# EAGLE design digital (EAGLE 6.5.0)
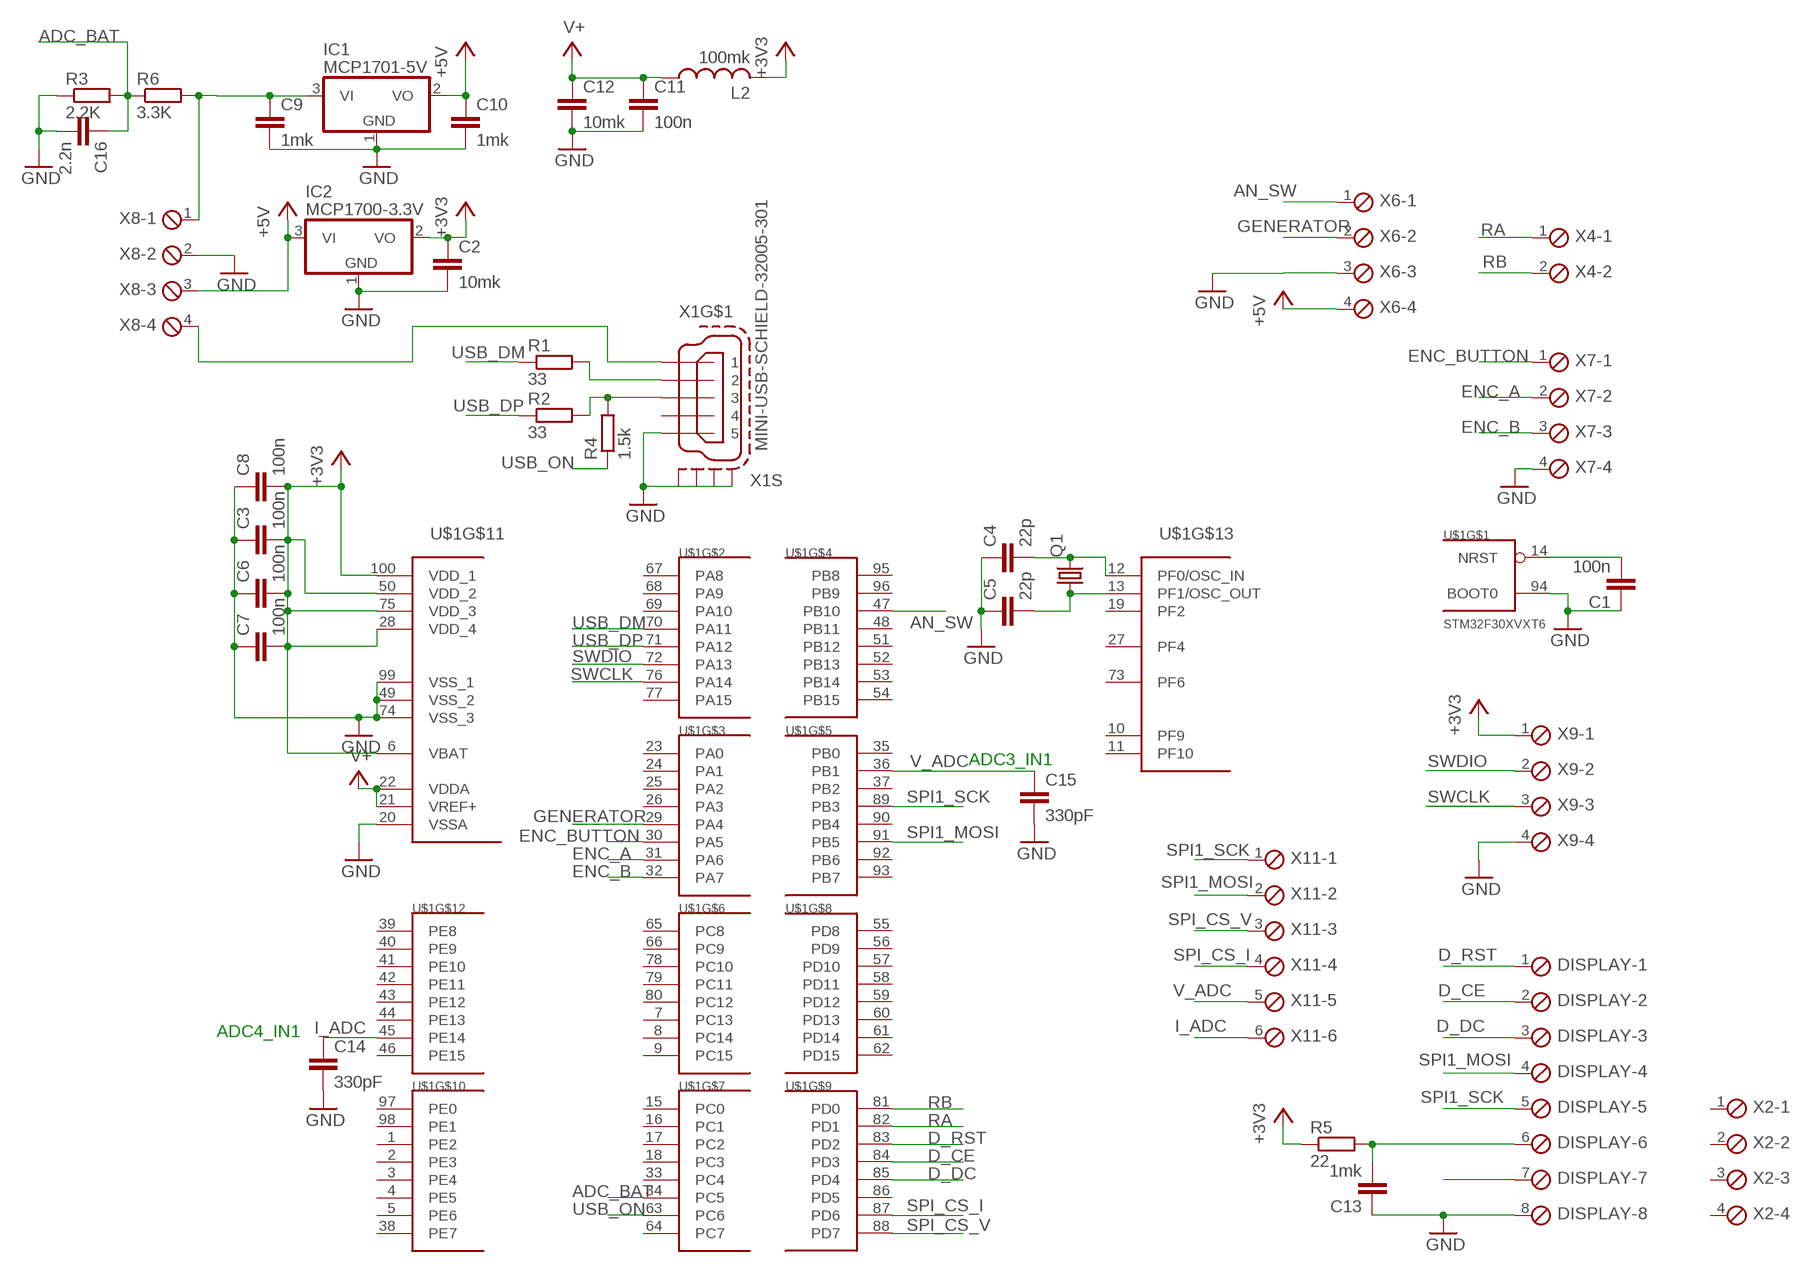
[diagram p0: schematic, sheet 1]

## Parts
C1  100n  C-EUC0603  [C0603]
C2  10mk  C-EUC0805  [C0805]
C3  100n  C-EUC0603  [C0603]
C4  22p  C-EUC0805  [C0805]
C5  22p  C-EUC0805  [C0805]
C6  100n  C-EUC0603  [C0603]
C7  100n  C-EUC0603  [C0603]
C8  100n  C-EUC0603  [C0603]
C9  1mk  C-EUC0603  [C0603]
C10  1mk  C-EUC0603  [C0603]
C11  100n  C-EUC0603  [C0603]
C12  10mk  C-EUC0805  [C0805]
C13  1mk  C-EUC0603  [C0603]
C14  330pF  C-EUC0805  [C0805]
C15  330pF  C-EUC0805  [C0805]
C16  2.2n  C-EUC0805  [C0805]
DISPLAY  MPT8  [8POL254]
IC1  MCP1701-5V  MCP1703CB  [SOT23]
IC2  MCP1700-3.3V  MCP1703CB  [SOT23]
L2  100mk  L-US0204/7  [0204/7]
Q1  CRYSTALHC49UP  [HC49UP]
R1  33  R-EU_R0603  [R0603]
R2  33  R-EU_R0603  [R0603]
R3  2.2K  R-EU_R0603  [R0603]
R4  1.5k  R-EU_R0603  [R0603]
R5  22  R-EU_R0603  [R0603]
R6  3.3K  R-EU_R0603  [R0603]
U$1  STM32F30XVXT6  [TQFP100]
X1  MINI-USB-SCHIELD-32005-301  [32005-301]
X2  MPT4  [4POL254]
X4  MPT2  [2POL254]
X6  MPT4  [4POL254]
X7  MPT4  [4POL254]
X8  MPT4  [4POL254]
X9  MPT4  [4POL254]
X11  MPT6  [6POL254]

## Nets
+3V3: C2.1 C3.2 C6.2 C7.2 C8.2 IC2.2(VO) L2.2 R5.1 U$1.6(VBAT) U$1.28(VDD_4) U$1.50(VDD_2) U$1.75(VDD_3) U$1.100(VDD_1) X9.1
+5V: C10.1 IC1.2(VO) IC2.3(VI) X6.4 X8.3
ADC_BAT: C16.1 R3.2 R6.1 U$1.34(PC5)
AN_SW: U$1.47(PB10) X6.1
D_CE: DISPLAY.2 U$1.84(PD3)
D_DC: DISPLAY.3 U$1.85(PD4)
D_RST: DISPLAY.1 U$1.83(PD2)
ENC_A: U$1.31(PA6) X7.2
ENC_B: U$1.32(PA7) X7.3
ENC_BUTTON: U$1.30(PA5) X7.1
GENERATOR: U$1.29(PA4) X6.2
GND: C1.1 C2.2 C3.1 C4.1 C5.1 C6.1 C7.1 C8.1 C9.2 C10.2 C11.2 C12.2 C13.1 C14.2 C15.2 C16.2 DISPLAY.8 IC1.1(GND) IC2.1(GND) R3.1 U$1.20(VSSA) U$1.49(VSS_2) U$1.74(VSS_3) U$1.94(BOOT0) U$1.99(VSS_1) X1.5 X1.M1(S:S1) X1.M2(S:S2) X1.M3(S:S3) X1.M4(S:S4) X6.3 X7.4 X8.2 X9.4
I_ADC: C14.1 U$1.45(PE14) X11.6
N$1: R1.2 X1.2
N$2: R2.2 R4.2 X1.3
N$3: C1.2 U$1.14(NRST)
N$4: C4.2 Q1.2 U$1.12(PF0/OSC_IN)
N$5: C5.2 Q1.1 U$1.13(PF1/OSC_OUT)
N$6: C13.2 DISPLAY.6 R5.2
N$7: C9.1 IC1.3(VI) R6.2 X8.1
N$8: X1.1 X8.4
N$13: DISPLAY.7
RA: U$1.82(PD1) X4.1
RB: U$1.81(PD0) X4.2
SPI1_MOSI: DISPLAY.4 U$1.91(PB5) X11.2
SPI1_SCK: DISPLAY.5 U$1.89(PB3) X11.1
SPI_CS_I: U$1.87(PD6) X11.4
SPI_CS_V: U$1.88(PD7) X11.3
SWCLK: U$1.76(PA14) X9.3
SWDIO: U$1.72(PA13) X9.2
USB_DM: R1.1 U$1.70(PA11)
USB_DP: R2.1 U$1.71(PA12)
USB_ON: R4.1 U$1.63(PC6)
V+: C11.1 C12.1 L2.1 U$1.21(VREF+) U$1.22(VDDA)
V_ADC: C15.1 U$1.36(PB1) X11.5
Unconnected: U$1.1(PE2) U$1.2(PE3) U$1.3(PE4) U$1.4(PE5) U$1.5(PE6) U$1.7(PC13) U$1.8(PC14) U$1.9(PC15) U$1.10(PF9) U$1.11(PF10) U$1.15(PC0) U$1.16(PC1) U$1.17(PC2) U$1.18(PC3) U$1.19(PF2) U$1.23(PA0) U$1.24(PA1) U$1.25(PA2) U$1.26(PA3) U$1.27(PF4) U$1.33(PC4) U$1.35(PB0) U$1.37(PB2) U$1.38(PE7) U$1.39(PE8) U$1.40(PE9) U$1.41(PE10) U$1.42(PE11) U$1.43(PE12) U$1.44(PE13) U$1.46(PE15) U$1.48(PB11) U$1.51(PB12) U$1.52(PB13) U$1.53(PB14) U$1.54(PB15) U$1.55(PD8) U$1.56(PD9) U$1.57(PD10) U$1.58(PD11) U$1.59(PD12) U$1.60(PD13) U$1.61(PD14) U$1.62(PD15) U$1.64(PC7) U$1.65(PC8) U$1.66(PC9) U$1.67(PA8) U$1.68(PA9) U$1.69(PA10) U$1.73(PF6) U$1.77(PA15) U$1.78(PC10) U$1.79(PC11) U$1.80(PC12) U$1.86(PD5) U$1.90(PB4) U$1.92(PB6) U$1.93(PB7) U$1.95(PB8) U$1.96(PB9) U$1.97(PE0) U$1.98(PE1) X1.4 X2.1 X2.2 X2.3 X2.4

## Notes on the sheet
- ADC3_IN1
- ADC4_IN1

## Library data of the parts
C1-C16 = rcl:C-EU: CAPACITOR, European symbol
DISPLAY = con-phoenix-254:MPT8: PHOENIX CONNECTOR; OC_FARNELL: unknown; OC_NEWARK: unknown
IC1 IC2 = linear:MCP1703: 250 mA, 16V, Low Quiescent Current LDO Regulator Source: http://ww1.microchip.com/downloads/en/DeviceDoc/22049b.pdf
L2 = rcl:L-US: INDUCTOR, American symbol
Q1 = crystal:CRYSTAL: CRYSTAL; OC_FARNELL: unknown; OC_NEWARK: unknown
R1-R6 = rcl:R-EU_: RESISTOR, European symbol
U$1 = stm32:STM32F30XVXT6
X1 = con-cypressindustries:MINI-USB-SCHIELD-: MINI USB-B Conector Source: www.cypressindustries.com; OC_FARNELL: unknown; OC_NEWARK: unknown
X2 X6-X9 = con-phoenix-254:MPT4: PHOENIX CONNECTOR; OC_FARNELL: unknown; OC_NEWARK: unknown
X4 = con-phoenix-254:MPT2: PHOENIX CONNECTOR; OC_FARNELL: unknown; OC_NEWARK: unknown
X11 = con-phoenix-254:MPT6: PHOENIX CONNECTOR; OC_FARNELL: unknown; OC_NEWARK: unknown

## Board
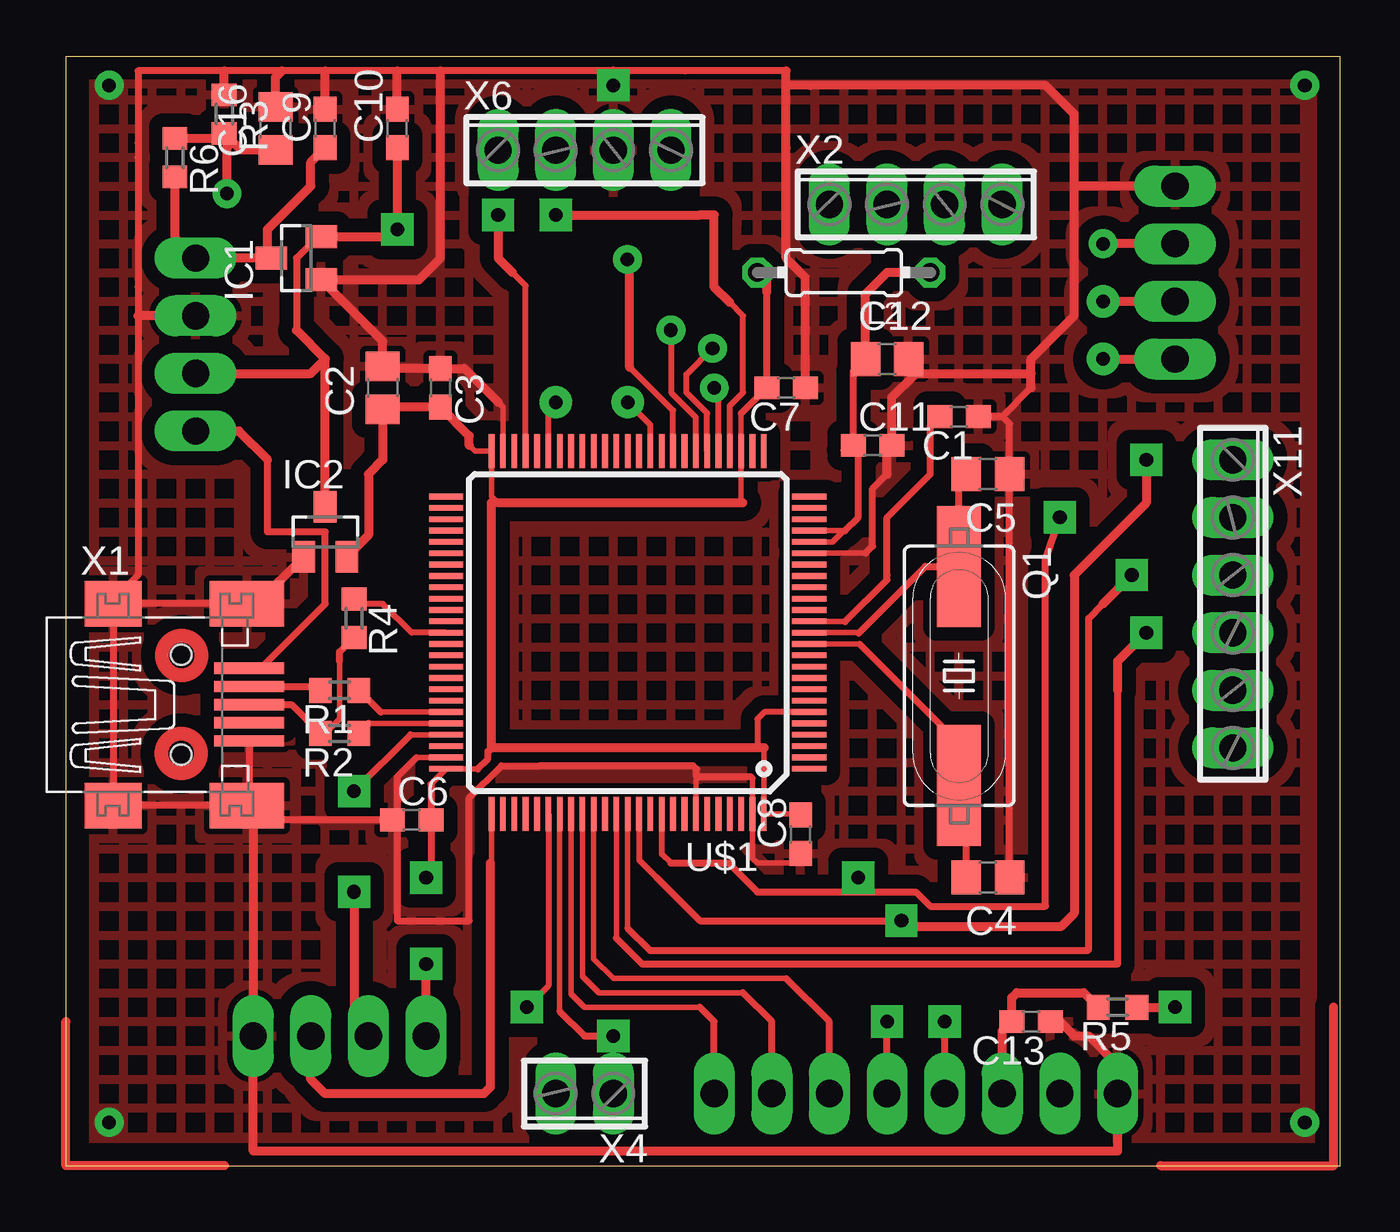
[diagram p1: board, top side]
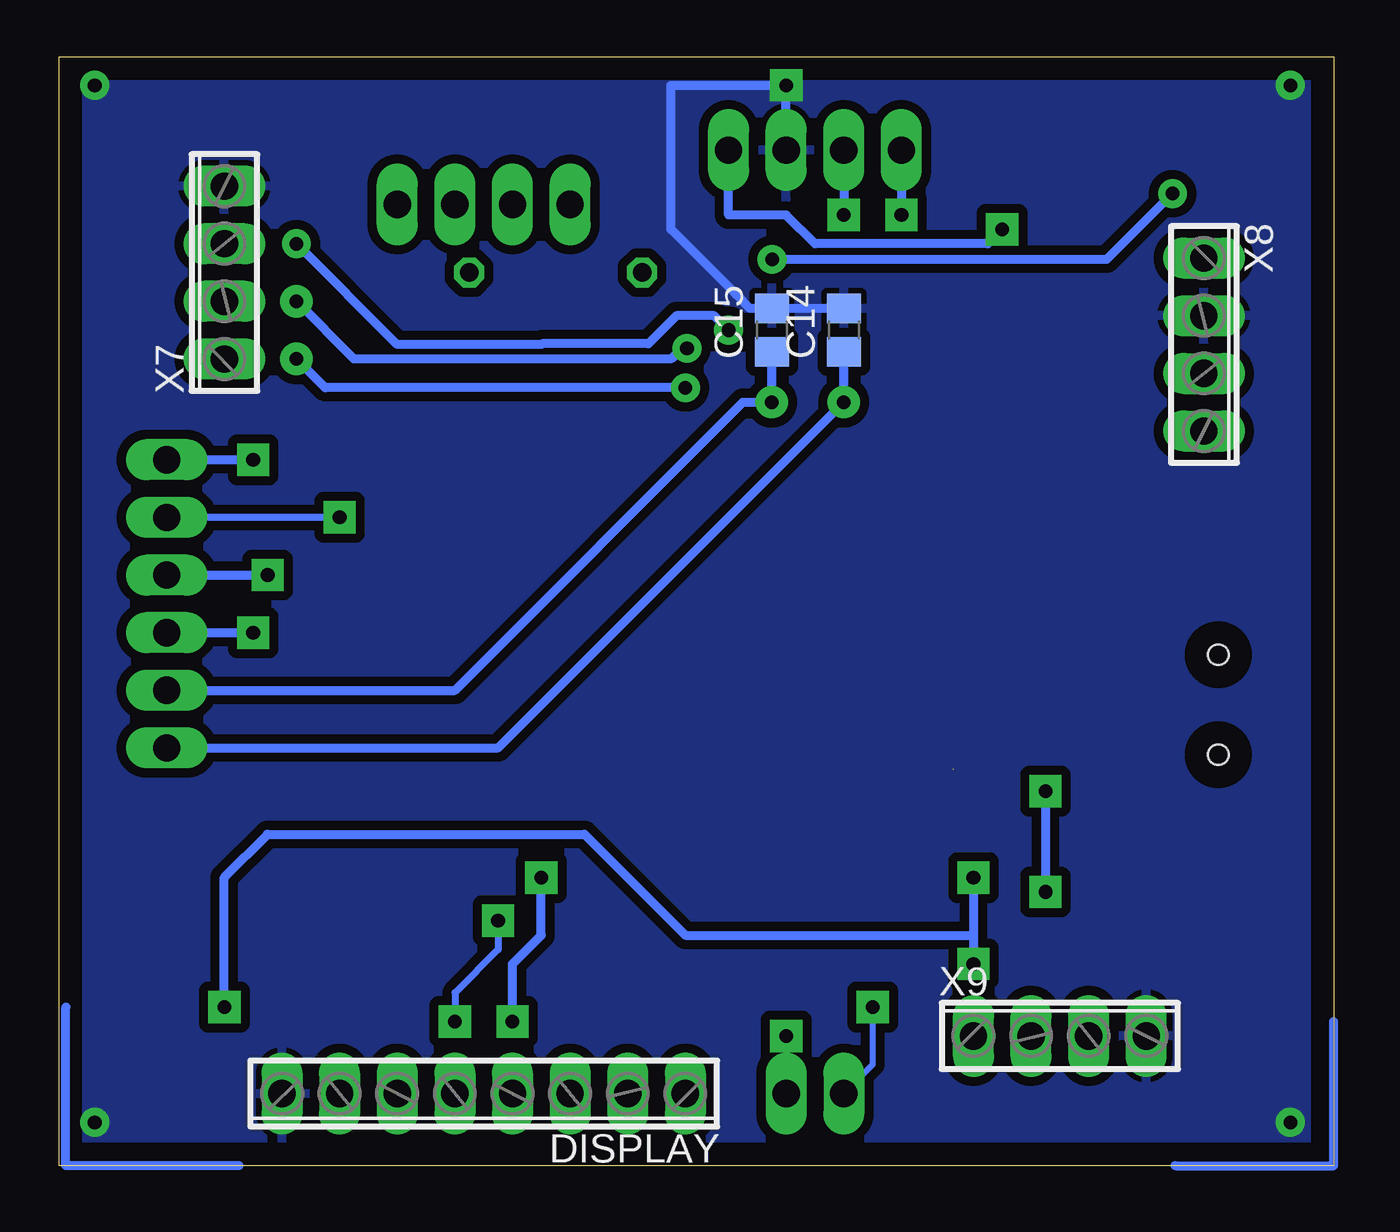
[diagram p2: board, bottom side, seen from below]

Size 56.19 x 48.88 mm. Coordinates in mm from the lower left corner, seen from the top.
Outline: 0,0 56.19,0 56.19,48.88 0,48.88 0,0
Copper layers (1*16): Top 0.035mm / dielectric 1.5mm / Bottom 0.035mm
Design rules "default": minimum track width 10mil, minimum drill 24mil, track to track 8mil, track to pad 8mil, pad to pad 8mil, via to via 8mil, smd to smd 8mil, copper to edge 40mil, drill to drill 8mil, minimum pad ring 10mil, minimum via ring 8mil, stop-mask expansion 4mil, vias tented up to drill 0mil, thermal gap 10mil

### Footprints (pad centres in the part's own frame; a part is rotated, then mirrored left to right if it is on the bottom)
C0603 = smd 1.1 x 1: 1 -0.85,0; 2 0.85,0
C0805 = smd 1.3 x 1.5: 1 -0.95,0; 2 0.95,0
8POL254 = drill 1.2 long: 1 -8.89,0; 2 -6.35,0; 3 -3.81,0; 4 -1.27,0; 5 1.27,0; 6 3.81,0; 7 6.35,0; 8 8.89,0
SOT23 = smd 1 x 1.4: 1 -0.95,-1.1; 2 0.95,-1.1; 3 0,1.1
0204/7 = drill 0.813 octagon: 1 -3.81,0; 2 3.81,0
HC49UP = smd 5.334 x 1.93: 1 -4.826,0; 2 4.826,0
R0603 = smd 1 x 1.1: 1 -0.85,0; 2 0.85,0
TQFP100 = smd 1.5 x 0.25: 1 -8,6; 2 -8,5.5; 3 -8,5; 4 -8,4.5; 5 -8,4; 6 -8,3.5; 7 -8,3; 8 -8,2.5; 9 -8,2; 10 -8,1.5; 11 -8,1; 12 -8,0.5; 13 -8,0; 14 -8,-0.5; 15 -8,-1; 16 -8,-1.5; 17 -8,-2; 18 -8,-2.5; 19 -8,-3; 20 -8,-3.5; 21 -8,-4; 22 -8,-4.5; 23 -8,-5; 24 -8,-5.5; 25 -8,-6; 51 8,-6; 52 8,-5.5; 53 8,-5; 54 8,-4.5; 55 8,-4; 56 8,-3.5; 57 8,-3; 58 8,-2.5; 59 8,-2; 60 8,-1.5; 61 8,-1; 62 8,-0.5; 63 8,0; 64 8,0.5; 65 8,1; 66 8,1.5; 67 8,2; 68 8,2.5; 69 8,3; 70 8,3.5; 71 8,4; 72 8,4.5; 73 8,5; 74 8,5.5; 75 8,6 | smd 0.25 x 1.5: 26 -6,-8; 27 -5.5,-8; 28 -5,-8; 29 -4.5,-8; 30 -4,-8; 31 -3.5,-8; 32 -3,-8; 33 -2.5,-8; 34 -2,-8; 35 -1.5,-8; 36 -1,-8; 37 -0.5,-8; 38 0,-8; 39 0.5,-8; 40 1,-8; 41 1.5,-8; 42 2,-8; 43 2.5,-8; 44 3,-8; 45 3.5,-8; 46 4,-8; 47 4.5,-8; 48 5,-8; 49 5.5,-8; 50 6,-8; 76 6,8; 77 5.5,8; 78 5,8; 79 4.5,8; 80 4,8; 81 3.5,8; 82 3,8; 83 2.5,8; 84 2,8; 85 1.5,8; 86 1,8; 87 0.5,8; 88 0,8; 89 -0.5,8; 90 -1,8; 91 -1.5,8; 92 -2,8; 93 -2.5,8; 94 -3,8; 95 -3.5,8; 96 -4,8; 97 -4.5,8; 98 -5,8; 99 -5.5,8; 100 -6,8
32005-301 = smd 3.1 x 0.5: 1 3,1.6; 2 3,0.8; 3 3,0; 4 3,-0.8; 5 3,-1.6 | smd 2.5 x 2: M1 -3,-4.45; M2 -3,4.45 | smd 3.3 x 2: M3 2.9,4.45; M4 2.9,-4.45 | hole 0.9: 0,2.2; 0,-2.2
4POL254 = drill 1.2 long: 1 -3.81,0; 2 -1.27,0; 3 1.27,0; 4 3.81,0
2POL254 = drill 1.2 long: 1 -1.27,0; 2 1.27,0
6POL254 = drill 1.2 pad 1.778 long: 1 -6.35,0; 2 -3.81,0; 3 -1.27,0; 4 1.27,0; 5 3.81,0; 6 6.35,0

### Placement (x,y rotation side)
C1  39.37,33.02 180 top
C2  13.97,34.29 90 top
C3  16.51,34.29 270 top
C4  40.64,12.7 180 top
C5  40.64,30.48 180 top
C6  15.24,15.24 0 top
C7  31.75,34.29 180 top
C8  32.38,14.61 90 top
C9  11.43,45.72 90 top
C10  14.61,45.72 90 top
C11  35.56,31.75 0 top
C12  36.2,35.56 0 top
C13  42.55,6.35 180 top
C14  21.59,36.83 90 bottom
C15  24.77,36.83 90 bottom
C16  9.24,45.72 90 top
DISPLAY  37.47,3.17 180 bottom
IC1  10.16,40.01 90 top
IC2  11.43,27.94 0 top
L2  34.29,39.37 180 top
Q1  39.37,21.59 270 top
R1  12.06,20.95 180 top
R2  12.06,19.05 180 top
R3  6.99,46.35 270 top
R4  12.7,24.13 270 top
R5  46.35,6.99 180 top
R6  4.8,44.44 270 top
U$1  24.77,23.5 180 top
X1  5.08,20.32 0 top
X2  37.47,42.38 0 top
X4  22.86,3.17 180 top
X6  22.86,44.77 0 top
X7  48.9,39.37 90 bottom
X8  5.71,36.2 270 bottom
X9  12.06,5.71 0 bottom
X11  51.44,24.77 270 top

### Tracks (layer width: path | path; a pad name or v marks a point on that pad's centre or on a via)
+3V3  (via drill 0.6 pad 1.42)  (1 unrouted)
  Top 0.25: 30.79,18.41 30.77,18.39 U$1.100 32.34,15.49 C8.2 | 18.15,17.48 16.78,17.48 16.75,17.48 16.09,16.82 | 19.05,29.21 18.77,29.5 U$1.50 18.04,31.5 17.78,31.75 | 29.84,29.21 29.77,29.29 U$1.28 29.77,33.16
  Top 0.254: U$1.6 30.79,20 30.48,19.68 30.48,18.41
  Top 0.305: 18.15,17.48 18.6,17.93 18.6,18.27 18.75,18.41 | 16.09,16.82 C6.2 16.09,12.91 v15.88,12.7 | 30.8,18.43 30.79,18.41 | 29.77,33.16 C7.2 30.9,38.52 | 19.05,29.21 18.75,29.21 | 12.7,26.52 IC2.2
  Top 0.406: 18.75,29.21 18.75,18.41 30.48,18.41 30.79,18.41 | 29.84,29.21 19.05,29.21 | IC2.2 13.34,27.8 13.34,30.48 13.97,31.11 C2.1 14.07,33.44 C3.2 17.78,32.17 17.78,31.75 | X9.1 v15.88,8.89 | 30.9,38.52 30.9,38.95 L2.2 | R5.1 v48.9,6.99
  Bottom 0.406: v15.88,12.7 15.88,10.16 | 15.88,10.16 v15.88,8.89 | v48.9,6.99 48.9,12.7 46.99,14.61 33.02,14.61 28.57,10.16 15.88,10.16
+5V  (via drill 0.6 pad 1.42)
  Top 0.305: 11.74,40.95 IC1.2 11.11,40.95 10.16,40.01 10.16,36.83
  Top 0.406: IC2.3 11.43,35.56 | 11.43,35.56 10.16,36.83 | X8.3 10.79,34.92 11.43,35.56 | 11.74,40.95 14.29,40.95 v14.61,41.27 C10.1
  Bottom 0.406: v14.61,41.27 15.24,40.64 22.86,40.64 24.13,41.91 26.67,41.91 X6.4
ADC_BAT  (via drill 0.6 pad 1.27)
  Top 0.254: U$1.34 26.77,33.28 24.85,35.2
  Top 0.406: C16.1 7.72,44.77 7.34,45.15 | 7.34,45.15 R3.2 6.76,45.28 R6.1 | 24.85,35.2 24.85,39.85 v24.75,39.95 | v7.1,42.85 7.1,44.9 7.34,45.15
  Bottom 0.406: v24.75,39.95 10,39.95 v7.1,42.85
AN_SW  (via drill 0.6 pad 1.42)
  Top 0.254: U$1.47 20.27,38.79 19.68,39.37
  Top 0.406: v19.05,41.91 19.05,40.01 19.68,39.37
  Bottom 0.406: X6.1 v19.05,41.91
D_CE
  Top 0.25: U$1.84 22.77,8.35 23.5,7.62 29.84,7.62
  Top 0.305: DISPLAY.2 31.11,6.35 29.84,7.62
D_DC
  Top 0.25: U$1.85 23.27,9.12 24.13,8.26 31.75,8.26
  Top 0.305: DISPLAY.3 33.66,6.35 31.75,8.26
D_RST
  Top 0.25: U$1.83 22.27,7.58 22.86,6.99 27.94,6.99
  Top 0.305: DISPLAY.1 28.57,6.35 27.94,6.99
ENC_A  (via drill 0.6 pad 1.27, 0.6 pad 1.42)
  Top 0.254: U$1.31 28.27,33.16 27.35,34.08 27.35,34.88 v28.5,36.03
  Top 0.406: v45.72,38.1 X7.2
  Bottom 0.406: v28.5,36.03 28.74,36.03 29.21,35.56 43.18,35.56 v45.72,38.1
ENC_B  (via drill 0.6 pad 1.27)
  Top 0.254: U$1.32 27.77,32.98 26.7,34.05 26.7,36.8 v26.67,36.83
  Top 0.406: X7.3 v45.72,40.64
  Bottom 0.406: v45.72,40.64 41.27,36.2 34.92,36.2 34.89,36.23 30.2,36.23 28.96,37.47 27.3,37.47 v26.67,36.83
ENC_BUTTON  (via drill 0.6 pad 1.27, 0.6 pad 1.42)
  Top 0.254: U$1.30 28.77,34.1 v28.57,34.29
  Top 0.406: v45.72,35.56 X7.1
  Bottom 0.406: v28.57,34.29 44.45,34.29 v45.72,35.56
GENERATOR  (via drill 0.6 pad 1.42)
  Top 0.254: U$1.29 29.27,33.49 29.85,34.08 29.85,37.46 29.27,38.05
  Top 0.406: v21.59,41.91 27.94,41.91 28.57,41.91 28.57,38.73 29.27,38.05
  Bottom 0.406: X6.2 v21.59,41.91
GND  (via drill 0.6 pad 1.27, 0.6 pad 1.42)
  Top 0.25: 30.25,17.08 30.27,17.07 U$1.99 30.27,13.55 30.48,13.34 31.96,13.34 C8.1 | U$1.94 27.77,16.97 27.94,17.14 | 15.46,18 15.44,17.98 15.46,18 | U$1.74 15.46,18 | U$1.49 19.27,33.44 19.05,33.66 | U$1.20 35.25,27
  Top 0.305: C6.1 14.61,15.03 14.61,10.79 17.78,10.79 17.78,16.21 19.2,17.63 20.9,17.63 27.65,17.63 27.8,17.48 27.8,17.14 27.94,17.14 30.18,17.14 30.25,17.08 | X1.M4 X1.M1 X1.M2 X1.M3 | 31.75,48.26 27.3,48.26 24.13,48.26 16.51,48.26 14.61,48.26 11.43,48.26 9.53,48.26 6.99,48.26 3.17,48.26 3.17,45.09 3.17,44.45 3.17,38.73 3.17,37.47 3.17,26.04 1.91,24.77 | 41.27,33.02 41.59,32.7 C5.1 C4.1 | 41.27,33.02 C1.1 41.27,33.02 | 41.27,33.02 42.55,34.29 | 15.44,17.98 14.61,17.14 14.61,15.46 C6.1 | C6.1 8.61,15.24 | 8.61,15.24 X1.M4 | X1.5 8.08,15.97 X1.M4 | 8.26,14.88 8.61,15.24 | 37.47,34.92 37.47,35.24 | 35.25,27 35.56,27.3 35.56,29.84 36.2,30.48
  Top 0.406: 8.26,14.88 X9.4 8.26,0.64 46.35,0.64 DISPLAY.8 46.35,4.45 45.09,5.71 44.45,5.71 43.81,6.35 C13.1 | 19.05,33.66 17.57,35.14 C3.1 14.07,35.14 C2.2 13.97,36.34 IC1.1 15.56,39.05 16.51,40.01 16.51,48.26 | X1.M3 8.41,24.77 IC2.1 | v24.13,47.62 24.13,48.26 | C7.1 32.6,39.16 31.75,40.01 31.75,44.87 31.75,47.62 | 44.45,43.18 44.45,37.47 42.55,35.56 42.55,34.92 | 44.45,43.18 44.45,46.35 43.18,47.62 32.81,47.62 31.75,47.62 | 42.55,34.29 42.55,34.92 | 31.75,47.62 31.75,48.26 | X7.4 44.45,43.18 | X8.2 3.17,37.47 | 42.55,34.92 37.47,34.92 36.41,33.87 C11.2 36.2,31.54 36.2,30.48 | C12.2 37.47,35.24 | C10.2 14.61,48.26 | C9.2 11.43,48.26 | C16.2 9.24,47.98 9.53,48.26 | R3.1 6.99,48.26
  Bottom 0.406: X6.3 v24.13,47.62 29.21,47.62 29.21,41.27 26.35,38.41 25.71,37.78 C15.2 C14.2
  other vias: 1.91,47.62 54.61,47.62 54.61,1.91 1.91,1.91
  pour Top (isolate 0.61, hatched): 0,0 56.52,0 56.52,49.53 0,49.53
  pour Bottom (isolate 0.406): 0,0 56.52,0 56.52,49.53 0,49.53
I_ADC  (via drill 0.6 pad 1.42)
  Top 0.254: U$1.45 21.27,33.33 v21.59,33.66
  Bottom 0.406: X11.6 36.83,18.41 v21.59,33.66 C14.1
N$1
  Top 0.305: X1.2 11.05,21.12 R1.2
N$2
  Top 0.25: R2.2 11.43,19.05 12.06,19.68 12.06,22.23
  Top 0.305: X1.3 9.95,20.32 R2.2 | 12.06,22.23 12.06,22.64 R4.2
N$3
  Top 0.25: U$1.14 34.34,24 34.35,23.98
  Top 0.305: 34.35,23.98 36.2,25.82 36.2,26.04 36.2,28.57 38.1,30.48 38.1,32.6 C1.2
N$4
  Top 0.25: U$1.12 34.98,23 35,22.98
  Top 0.305: 35,22.98 39.37,18.61 Q1.2 | Q1.2 39.62,16.51 | 39.69,16.44 Q1.2 | C4.2 39.69,16.44 | 39.69,16.44 Q1.2
N$5
  Top 0.25: U$1.13 34.94,23.5 34.95,23.48
  Top 0.305: 34.95,23.48 37.89,26.42 Q1.1 39.37,30.16 C5.2
N$6
  Top 0.406: DISPLAY.6 41.27,5.93 C13.2 41.7,7.41 41.91,7.62 44.87,7.62 R5.2
N$7
  Top 0.406: C9.1 10.79,44.23 10.79,43.18 8.89,41.27 8.89,40.17 IC1.3 X8.1 4.8,40.91 R6.2
N$8
  Top 0.305: X1.1 8.59,21.92 11.43,24.77 11.43,27.94 8.89,27.94 8.89,31.11
  Top 0.406: X8.4 7.62,32.38 8.89,31.11
N$9
  Bottom 0.406: 6.99,0 0,0 0,6.35
N$10
  Top 0.406: 6.99,0 0,0 0,6.35
N$11
  Top 0.406: 48.26,0 55.88,0 55.88,6.99
N$12
  Bottom 0.406: 48.26,0 55.88,0 55.88,6.99
RA  (via drill 0.6 pad 1.42)
  Top 0.25: U$1.82 21.77,6.81
  Top 0.305: 21.77,6.81 22.86,5.71 v24.13,5.71
  Bottom 0.305: v24.13,5.71 X4.1
RB  (via drill 0.6 pad 1.42)
  Top 0.254: U$1.81 21.27,7.93 v20.32,6.99
  Bottom 0.254: v20.32,6.99 20.32,4.45 X4.2
SPI1_MOSI  (via drill 0.6 pad 1.42)
  Top 0.254: U$1.91 26.27,13.74 26.67,13.34
  Top 0.305: 26.67,13.34 29.21,13.34 30.48,12.06 34.92,12.06 | 34.92,12.06 36.2,12.06 37.47,12.06 38.1,11.43 43.18,11.43 43.18,26.67 v43.81,28.57 | DISPLAY.4 v36.2,6.35 | v34.92,12.7 34.92,12.06
  Bottom 0.305: v43.81,28.57 X11.2
  Bottom 0.406: v36.2,6.35 36.2,8.89 34.92,10.16 v34.92,12.7
SPI1_SCK  (via drill 0.6 pad 1.42)
  Top 0.254: U$1.89 25.27,13.47 26.04,12.7
  Top 0.305: 26.04,12.7 27.94,10.79 v36.83,10.79 | v38.73,6.35 DISPLAY.5
  Top 0.406: v36.83,10.79 37.09,10.53 43.85,10.53 44.45,11.13 44.45,26.04 47.62,29.21 v47.62,31.11
  Bottom 0.305: v36.83,10.79 36.83,9.53 38.73,7.62 v38.73,6.35
  Bottom 0.406: X11.1 v47.62,31.11
SPI_CS_I  (via drill 0.6 pad 1.42)
  Top 0.25: U$1.87 24.27,10.03
  Top 0.305: 46.35,20.95 46.35,8.89 25.4,8.89 24.27,10.03
  Top 0.406: v47.62,23.5 46.35,22.23 46.35,20.95
  Bottom 0.406: X11.4 v47.62,23.5
SPI_CS_V  (via drill 0.6 pad 1.42)
  Top 0.25: U$1.88 24.77,10.46
  Top 0.305: 45.72,24.77 45.09,24.13 45.09,9.53 45.04,9.48 25.75,9.48 24.77,10.46
  Top 0.406: v46.99,26.04 45.72,24.77
  Bottom 0.406: X11.3 v46.99,26.04
SWCLK
  Top 0.25: U$1.76 18.77,13.39 18.7,13.33
  Top 0.406: 18.7,13.33 18.7,3.46 18.41,3.17 11.43,3.17 10.79,3.81 X9.3
SWDIO  (via drill 0.6 pad 1.42)
  Top 0.25: U$1.72 15.19,19
  Top 0.305: 15.19,19 v12.7,16.51
  Top 0.406: v12.7,12.06 12.7,6.35 X9.2
  Bottom 0.406: v12.7,16.51 v12.7,12.06
USB_DM
  Top 0.25: U$1.70 13.88,20
  Top 0.305: 13.88,20 R1.1
USB_DP
  Top 0.25: U$1.71 13.36,19.5
  Top 0.305: 13.36,19.5 R2.1
USB_ON
  Top 0.254: U$1.63 15.24,23.5 13.97,24.77 12.91,24.77 R4.1
V+
  Top 0.25: U$1.22 34.29,28 | 34.29,28 34.34,28 | U$1.21 33.79,27.5 34.29,28
  Top 0.305: 34.34,28 34.92,28.57 34.92,29.84 34.92,31.54 C11.1 | 34.29,31.54 C11.1 | C11.1 34.71,35.02 C12.1
  Top 0.406: L2.1 36.2,39.37 35.24,38.42 C12.1
V_ADC  (via drill 0.6 pad 1.42)
  Top 0.254: U$1.36 25.77,32.66 v24.77,33.66
  Bottom 0.406: X11.5 38.73,20.95 26.04,33.66 v24.77,33.66 C15.1
(copper drawn outside any net)
  shapes: Top circle x2